# Altium project Laser_driver.PrjPCB (part 1 of 3)
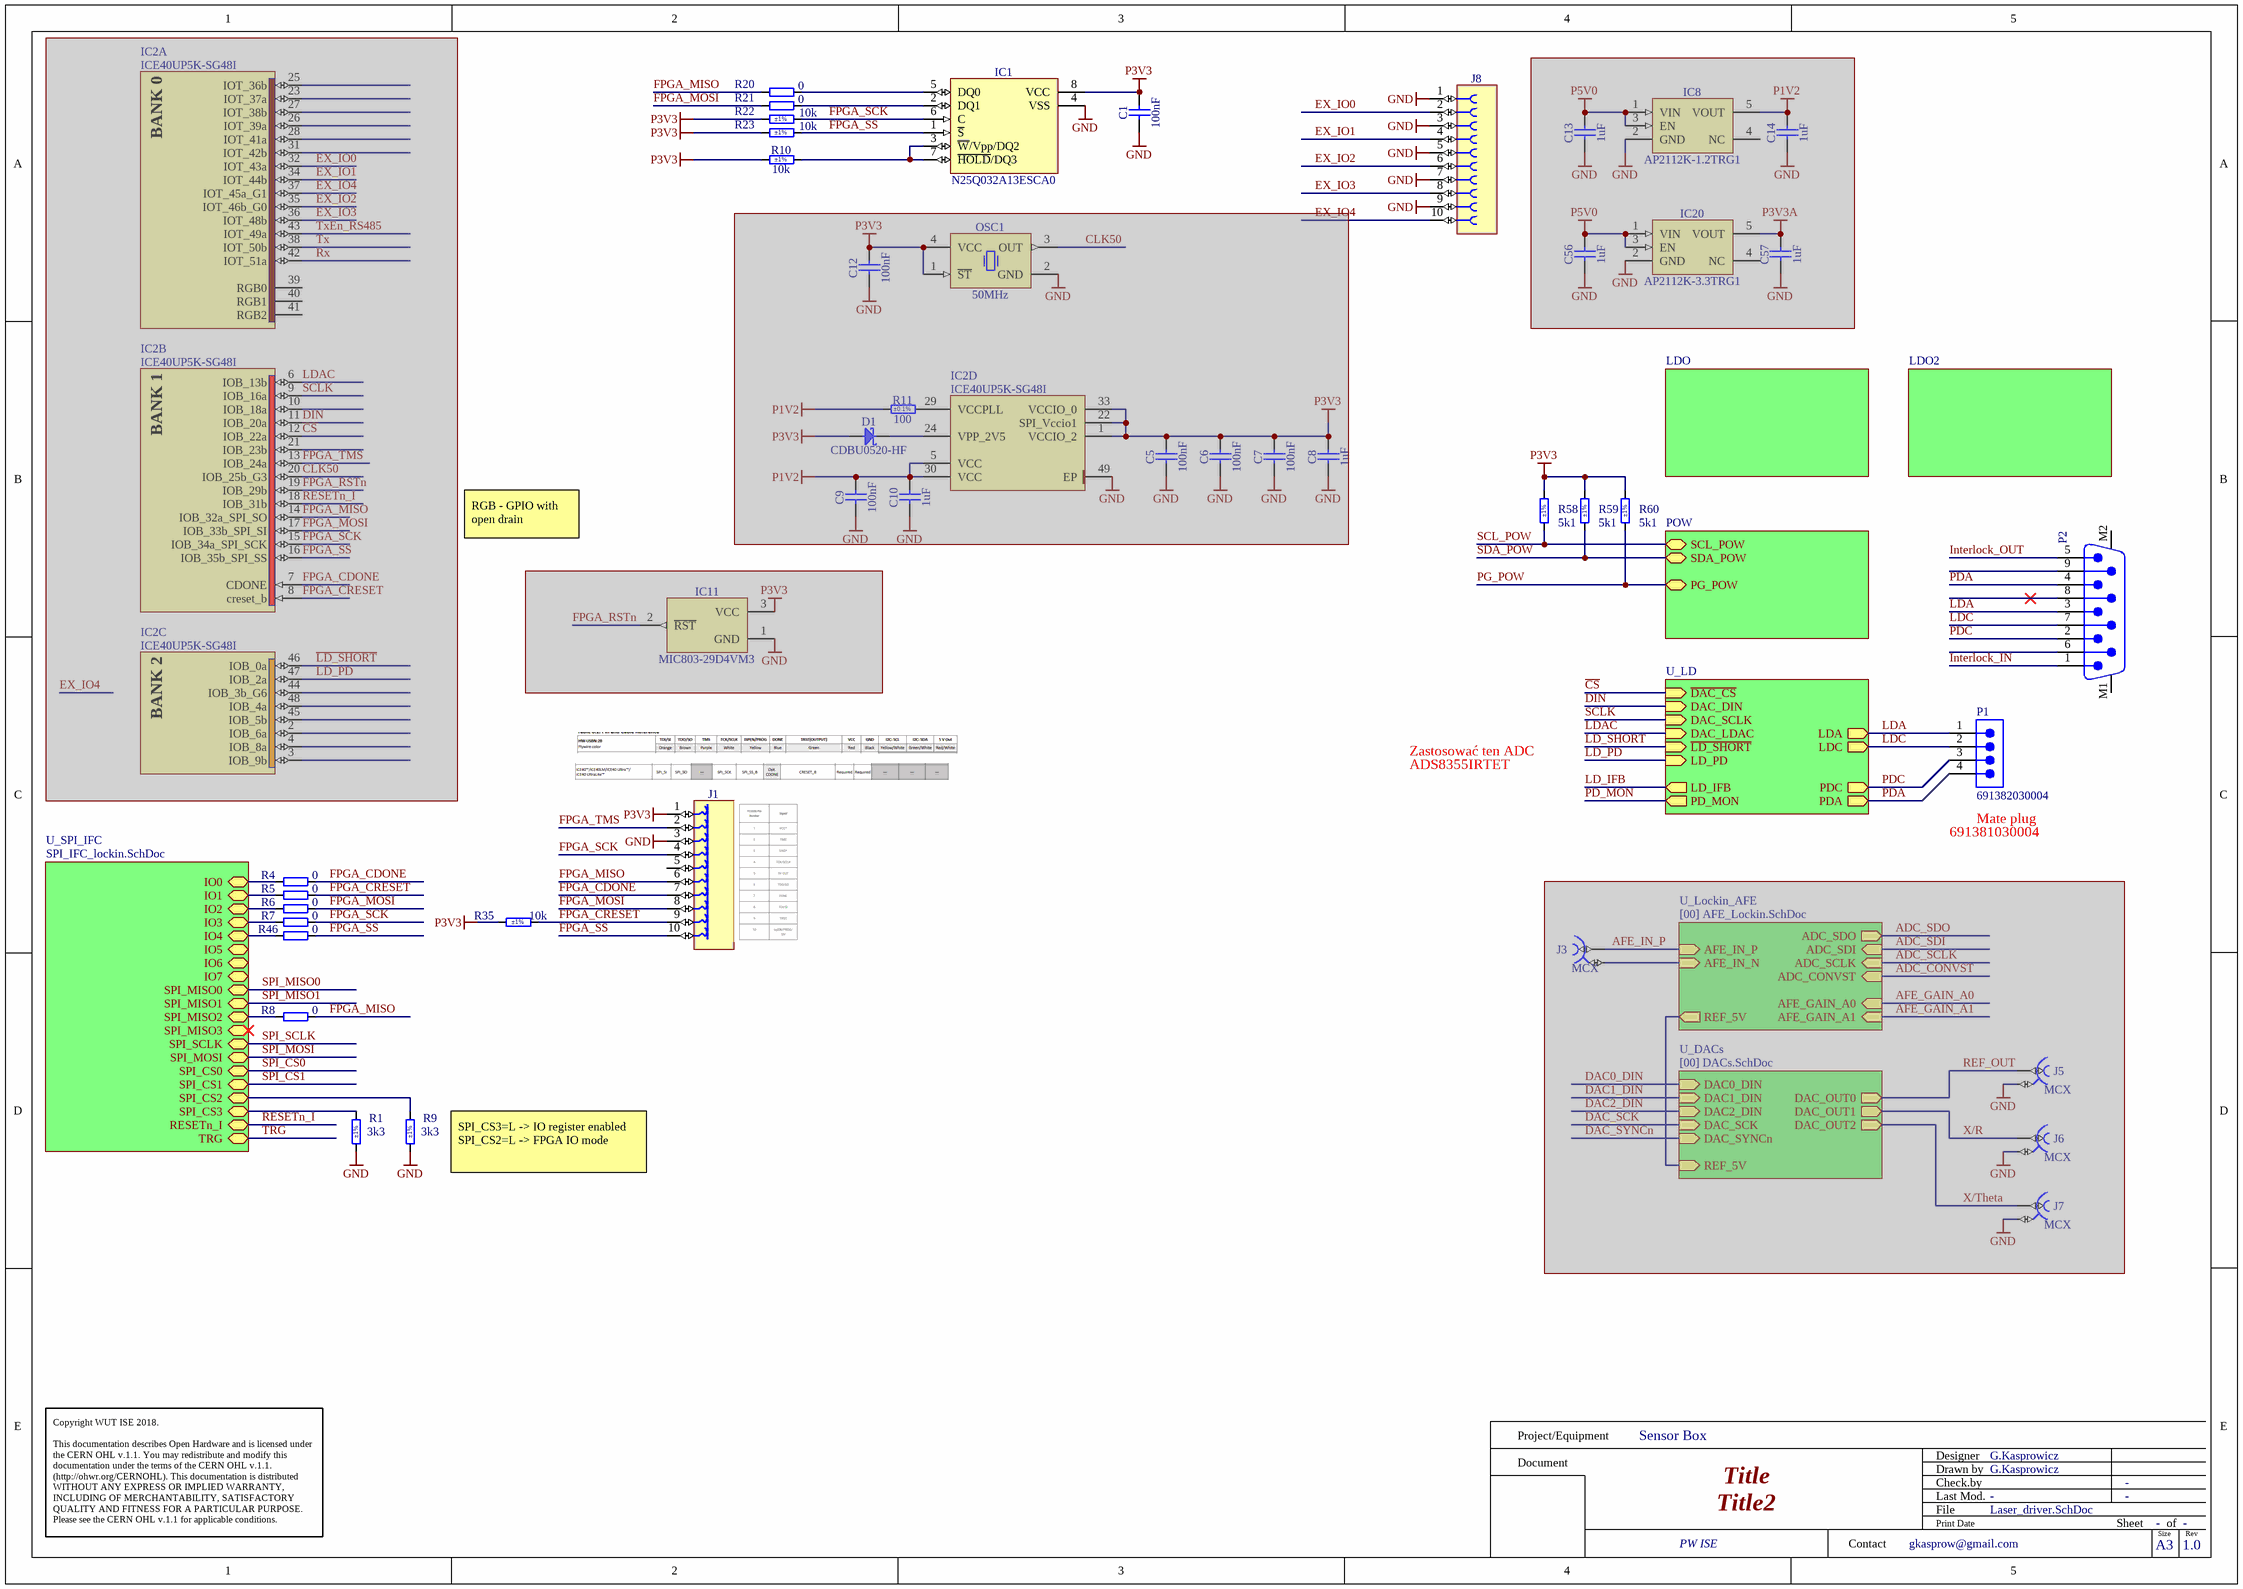
[diagram p0: Laser_driver.SchDoc]
5 sheets, 289 parts. Net scope: hierarchical (ports join the sheet entries above them; power ports are global).
Board file: Laser_driver.PCBDOC
Sheets:
  Laser_driver.SchDoc
    U_SPI_IFC = SPI_IFC_lockin.SchDoc
    U_LD = LD.SchDoc
    LDO = LDO_LD.SchDoc
    LDO2 = OPAmp Supply.SchDoc

## Sheet Laser_driver.SchDoc: Title
size 420 x 297 mm; Author: G.Kasprowicz; CompanyName: WUT ISE; DrawnBy: G.Kasprowicz; Organization: WUT ISE; Address1: PW ISE; Address2: Nowowiejska 15/19 00-665 Warsaw; Address3: gkasprow@gmail.com; Revision: 1.0; SheetNumber: -; SheetTotal: -; ModifiedBy: -; CheckedDate: -; Title2: Title2; DivGrp: WUT ISE; Designer: G.Kasprowicz; SPICEModelCacheRYPVXPCY: <root> / <DocumentId>RYPVXPCY</DocumentId> / </root>; ModifiedDate: -; ProjectName: Sensor Box

### Parts
C1  100nF  [CAPC1005X55N]
C5  100nF  [CAPC1005X55N]  (masked out: inside a compile mask, not in the netlist)
C6  100nF  [CAPC1005X55N]  (masked out: inside a compile mask, not in the netlist)
C7  100nF  [CAPC1005X55N]  (masked out: inside a compile mask, not in the netlist)
C8  1uF  [CAPC1005X55N]  (masked out: inside a compile mask, not in the netlist)
C9  100nF  [CAPC1005X55N]  (masked out: inside a compile mask, not in the netlist)
C10  1uF  [CAPC1005X55N]  (masked out: inside a compile mask, not in the netlist)
C12  100nF  [CAPC1005X55N]  (masked out: inside a compile mask, not in the netlist)
C13  1uF  [CAPC1005X55N]  (masked out: inside a compile mask, not in the netlist)
C14  1uF  [CAPC1005X55N]  (masked out: inside a compile mask, not in the netlist)
C56  1uF  [CAPC1005X55N]  (masked out: inside a compile mask, not in the netlist)
C57  1uF  [CAPC1005X55N]  (masked out: inside a compile mask, not in the netlist)
D1  CDBU0520-HF  [SOD-523F]  (masked out: inside a compile mask, not in the netlist)
IC1  N25Q032A13ESCA0  [SOIC127P600X175-8N]
IC2  ICE40UP5K-SG48I  [QFN50P700X700X100-49N-S550]  (parts A,B,C,D of 4)  (masked out: inside a compile mask, not in the netlist)
IC8  AP2112K-1.2TRG1  [SOT95P285X140-5N]  (masked out: inside a compile mask, not in the netlist)
IC11  MIC803-29D4VM3  [SOT95P237X112-3N]  (masked out: inside a compile mask, not in the netlist)
IC20  AP2112K-3.3TRG1  [SOT95P285X140-5N]  (masked out: inside a compile mask, not in the netlist)
J1  TC2050-IDC  [TC2050-IDC]  (value not drawn)
J3  MCX  [AMPHENOL_919-109J-51PX]  (masked out: inside a compile mask, not in the netlist)
J5  MCX  [AMPHENOL_919-109J-51PX]  (masked out: inside a compile mask, not in the netlist)
J6  MCX  [AMPHENOL_919-109J-51PX]  (masked out: inside a compile mask, not in the netlist)
J7  MCX  [AMPHENOL_919-109J-51PX]  (masked out: inside a compile mask, not in the netlist)
J8  FFC/FPC  [MOLEX_52745-1097]  (value not drawn)
OSC1  50MHz  [OSC_EPSON_SG-310]  (masked out: inside a compile mask, not in the netlist)
P1  691382030004  [691382030004]
P2  61800929221  [61800929221]  (value not drawn)
R1  3k3  Tolerance: ±1%  [RESC1005X40N]
R4  0  [RESC1005X40N]
R5  0  [RESC1005X40N]
R6  0  [RESC1005X40N]
R7  0  [RESC1005X40N]
R8  0  [RESC1005X40N]
R9  3k3  Tolerance: ±1%  [RESC1005X40N]
R10  10k  Tolerance: ±1%  [RESC1005X40N]
R11  100  Tolerance: ±0.1%  [RESC1005X35N]  (masked out: inside a compile mask, not in the netlist)
R20  0  [RESC1005X40N]
R21  0  [RESC1005X40N]
R22  10k  Tolerance: ±1%  [RESC1005X40N]
R23  10k  Tolerance: ±1%  [RESC1005X40N]
R35  10k  Tolerance: ±1%  [RESC1005X40N]
R46  0  [RESC1005X40N]
R58  5k1  Tolerance: ±1%  [RESC1005X40N]
R59  5k1  Tolerance: ±1%  [RESC1005X40N]
R60  5k1  Tolerance: ±1%  [RESC1005X40N]

### Sub-sheets
LDO = LDO_LD.SchDoc: no entries
LDO2 = OPAmp Supply.SchDoc: no entries
POW = [05] POW_LD.SchDoc (file not in this document): SDA_POW (bidir), SCL_POW (bidir), PG_POW (bidir)
U_DACs = [00] DACs.SchDoc (masked out) (file not in this document): DAC0_DIN (in), DAC_SCK (in), DAC_SYNCn (in), DAC1_DIN (in), DAC2_DIN (in), REF_5V (in), DAC_OUT0 (out), DAC_OUT1 (out), DAC_OUT2 (out)
U_LD = LD.SchDoc: LDA (out), LDC (out), PDC (out), PDA (out), ~{LD_SHORT} (in), LD_PD (in), PD_MON (out), ~{DAC_CS} (in), DAC_DIN (in), DAC_SCLK (in), DAC_LDAC (in), LD_IFB (out)
U_Lockin_AFE = [00] AFE_Lockin.SchDoc (masked out) (file not in this document): ADC_SDI (in), ADC_SCLK (in), ADC_SDO (out), ADC_CONVST (in), AFE_GAIN_A0 (in), AFE_GAIN_A1 (in), AFE_IN_N (in), AFE_IN_P (in), REF_5V (out)
U_SPI_IFC = SPI_IFC_lockin.SchDoc: IO0 (bidir), IO1 (bidir), IO2 (bidir), IO3 (bidir), IO4 (bidir), IO5 (bidir), IO6 (bidir), IO7 (bidir), SPI_MISO0 (bidir), SPI_MISO1 (bidir), SPI_MISO2 (bidir), SPI_MISO3 (bidir), SPI_SCLK (bidir), SPI_MOSI (bidir), SPI_CS0 (bidir), SPI_CS1 (bidir), SPI_CS2 (bidir), SPI_CS3 (bidir), RESETn_I (bidir), TRG (bidir)

### Nets
LDC: C1.1 IC1.4(VSS) J1.3 J8.1 J8.3 J8.5 J8.7 J8.9 P1.2 P2.7 R1.2 R9.2 ; sheet U_LD/LDC  [also labelled GND]
P3V3: C1.2 IC1.8(VCC) J1.1 R10.1 R22.1 R23.1 R35.1 R58.1 R59.1 R60.1
~{CS}: sheet U_LD/~{DAC_CS}
DIN: sheet U_LD/DAC_DIN  [project net DAC_DIN]
EX_IO0: J8.2
EX_IO1: J8.4
EX_IO2: J8.6
EX_IO3: J8.8
FPGA_CDONE: J1.7 R4.2
FPGA_CRESET: J1.9 R5.2 R35.2
FPGA_MISO: J1.6 R8.2 R20.1
FPGA_MOSI: J1.8 R6.2 R21.1
FPGA_SCK: IC1.6(C) J1.4 R7.2 R22.2
FPGA_SS: IC1.1(~{S}) J1.10 R23.2 R46.2
FPGA_TMS: J1.2
Interlock_IN: P2.1
Interlock_OUT: P2.5
IO0: R4.1 ; sheet U_SPI_IFC/IO0
IO1: R5.1 ; sheet U_SPI_IFC/IO1
IO2: R6.1 ; sheet U_SPI_IFC/IO2
IO3: R7.1 ; sheet U_SPI_IFC/IO3
IO4: R46.1 ; sheet U_SPI_IFC/IO4
LDA: P1.1 P2.3 ; sheet U_LD/LDA
LDAC: sheet U_LD/DAC_LDAC  [project net DAC_~{LDAC}]
PDA: P1.4 P2.4 ; sheet U_LD/PDA
PDC: P1.3 P2.2 ; sheet U_LD/PDC
PG_POW: R60.2 ; sheet POW/PG_POW
SCL_POW: R58.2 ; sheet POW/SCL_POW
SCLK: sheet U_LD/DAC_SCLK  [project net DAC_SCLK]
SDA_POW: R59.2 ; sheet POW/SDA_POW
SPI_CS2: R9.1 ; sheet U_SPI_IFC/SPI_CS2
SPI_CS3: R1.1 ; sheet U_SPI_IFC/SPI_CS3
SPI_MISO2: R8.1 ; sheet U_SPI_IFC/SPI_MISO2
NetIC1_2: IC1.2(DQ1) R21.2
NetIC1_3: IC1.3(~{W}/Vpp/DQ2) IC1.7(~{HOLD}/DQ3) R10.2
NetIC1_5: IC1.5(DQ0) R20.2

Not connected (* = marked no-connect by the designer): J1 5; J8 10; P2 6 8* 9 M1 M2

### Notes on the sheet
- RGB - GPIO with open drain
- ADS8355IRTET
- Zastosować ten ADC
- (near P1) 691381030004
- (near P1) Mate plug
- (near R9) SPI_CS3=L -> IO register enabled
  SPI_CS2=L -> FPGA IO mode
- Project/Equipment
- Document
- Designer
- Drawn by
- Check.by
- Copyright WUT ISE 2018.
  This documentation describes Open Hardware and is licensed under the CERN OHL v.1.1. You may redistribute and modify this documentation under the terms of the CERN OHL v.1.1. (http://ohwr.org/CERNOHL). This documentation is distributed WITHOUT ANY EXPRESS OR IMPLIED WARRANTY, INCLUDING OF MERCHANTABILITY, SATISFACTORY QUALITY AND FITNESS FOR A PARTICULAR PURPOSE. Please see the CERN OHL v.1.1 for applicable conditions.
- Contact
- File
- Last Mod.
- Print Date
- Sheet
- Size
- A3
- of
- Rev
- (in symbol ICE40UP5K-SG48I, part A) BANK 0
- (in symbol ICE40UP5K-SG48I, part B) BANK 1
- (in symbol ICE40UP5K-SG48I, part C) BANK 2

### Library data of the parts
C1 C5-C7 C9 C12 = CC0402_100NF_16V_10%_X7R: Non-polarised capacitor; Part Description: SMD Multilayer Chip Ceramic Capacitor; Manufacturer: GENERIC; Manufacturer1 Part Number: GRM155R71C104KA88D; Voltage: 16V; TC: X7R; Tolerance: ±10%; Part Number: CC0402_100NF_16V_10%_X7R; Component Kind: Standard; Component Type: Standard; Pin Count: 2; Value: 100nF; Status: Not Recommended; Manufacturer Part Number: CC0402_100NF_16V_10%_X7R; Case: 0402; Mounted: Yes; Socket: No; SMD: Yes; Sense: No; Manufacturer1 Example: MURATA; Manufacturer1 ComponentHeight: 0.55mm; HelpURL: \\cern.ch\dfs\Applications\Altium\Datasheets\CC0402_X7R_MURATA_GRM.pdf; Author: CERN DEM JLC; CreateDate: 05.12.2013; LatestRevisionDate: 03.12.2007
C8 C10 C13 C14 C56 C57 = CC0402_1UF_16V_10%_X5R: Non-polarised capacitor; Part Description: SMD Multilayer Chip Ceramic Capacitor; Manufacturer: GENERIC; Manufacturer1 Part Number: C1005X5R1C105KT; Voltage: 16V; TC: X5R; Tolerance: ±10%; Part Number: CC0402_1UF_16V_10%_X5R; Component Kind: Standard; Component Type: Standard; Pin Count: 2; Value: 1uF; Status: Preferred; Manufacturer Part Number: CC0402_1UF_16V_10%_X5R; Case: 0402; Mounted: Yes; Socket: No; SMD: Yes; Sense: No; Manufacturer1 Example: TDK; Manufacturer1 ComponentHeight: 0.55mm; HelpURL: \\cern.ch\dfs\Applications\Altium\Datasheets\CC0402_X5R_TDK_C.pdf; Author: CERN DEM JLC; CreateDate: 25.10.2012; LatestRevisionDate: 25.10.2012
D1 = CDBU0520-HF: Schottky Diode; Part Description: 20V Surface mount Schottky Barrier Diode; Manufacturer: COMCHIP; Voltage: 20V; Power: 500mA; PressFit: No; Bonding: No; Part Number: CDBU0520-HF; Component Kind: Standard; Component Type: Standard; Device: CDBU0520-HF; PackageDescription: Small Outline Diode Flat Lead (SOD-523F), Body; 1.80mm L X 1mm W X 0.85mm H; Manufacturer Part Number: CDBU0520-HF; Pin Count: 2; Case: SOD-523F; Mounted: Yes; Socket: No; SMD: Yes; Sense: No; ComponentHeight: 1mm; HelpURL: \\cern.ch\dfs\Applications\Altium\Datasheets\CDBU0520-HF.pdf; Author: CERN DEM HF; CreateDate: 13.10.2023; LatestRevisionDate: 13.10.2023
IC1 = N25Q032A13ESCA0: 32Mb, 3V, Multiple I/O Serial Flash Memory; Part Description: 32Mb, 2.7 to 3.6V, Multiple I/O Serial Flash Memory; Manufacturer: MICRON TECHNOLOGY; PressFit: No; Bonding: No; Part Number: N25Q032A13ESCA0; Component Kind: Standard; Component Type: Standard; Device: N25Q032A13ESCA0; PackageDescription: SOIC, 1.27mm Pitch; 8 Pin - Body 4x5mm, IPC Medium Density; Manufacturer Part Number: N25Q032A13ESCA0; Pin Count: 8; Case: SOIC8; Mounted: Yes; Socket: No; SMD: Yes; Sense: No; ComponentHeight: 1.75mm; HelpURL: \\cern.ch\dfs\Applications\Altium\Datasheets\N25Q032A13ESCA0.pdf; Author: CERN DEM HF; CreateDate: 09.12.2024; LatestRevisionDate: 09.12.2024
IC2 = ICE40UP5K-SG48I: ICE40 Ultra FPGA, 3520 Logic Cells, 400 kHz Data Transfer Speed, 48 pin QFN; Part Description: ICE40 Ultra FPGA, 5280 Logic Cells, 400 kHz Data Transfer Speed, 48 pin QFN; Manufacturer: LATTICE SEMICONDUCTOR; PressFit: No; Bonding: No; Part Number: ICE40UP5K-SG48I; Component Kind: Standard; Component Type: Standard; Device: ICE40UP5K-SG48I; PackageDescription: QFN, 0.50mm Pitch, Square; 48 Pin, 7.00mm L X 7.00mm W X 1.00mm H body (w/Thermal Tab 5.50mm X 5.40mm), IPC Medium Density; Manufacturer Part Number: ICE40UP5K-SG48I; Pin Count: 49; Case: QFN48; Mounted: Yes; Socket: No; SMD: Yes; Sense: No; ComponentHeight: 1.00mm; HelpURL: \\cern.ch\dfs\Applications\Altium\Datasheets\ICE40UP5K.pdf; ComponentLink1URL: \\cern.ch\dfs\Applications\Altium\Datasheets\LATTICE_Packege.pdf; ComponentLink1Description: Package; ComponentLink2URL: \\cern.ch\dfs\Applications\Altium\Datasheets\ICE40UP5K_Pinout.xlsx; ComponentLink2Description: Pinout; Author: CERN DEM HF; CreateDate: 16.12.2024; LatestRevisionDate: 16.12.2024
IC8 = REG_AP2112K-1.2: 600mA CMOS Low Dropout Linear Regulator with Enable; Part Description: 1.2V 600mA CMOS Low Dropout Linear Regulator with Enable; Manufacturer: DIODES INCORPORATED; PressFit: No; Bonding: No; Part Number: AP2112K-1.2TRG1; Component Kind: Standard; Component Type: Standard; Device: AP2112K-1.2TRG1; PackageDescription: SOT23, 0.95mm Pitch; 5 Pin, 1.6mm W X 3.0mm L X 1.40mm H body, IPC Medium Density; Manufacturer Part Number: AP2112K-1.2TRG1; Pin Count: 5; Case: SOT25; Mounted: Yes; Socket: No; SMD: Yes; Sense: No; ComponentHeight: 1.4mm; HelpURL: \\cern.ch\dfs\Applications\Altium\Datasheets\AP2112K-3.3TRG1.pdf; Author: GK; CreateDate: 13.12.2017; LatestRevisionDate: 27.06.2022
IC11 = MIC803-29D4VM3: 3.075V Microprocessor Supervisor Circuit With Open-Drain Reset Output; Part Description: 2.93V Microprocessor Supervisor Circuit with Open-Drain Reset Output; Manufacturer: MICROCHIP TECHNOLOGY; PressFit: No; Bonding: No; Part Number: MIC803-29D4VM3; Component Kind: Standard; Component Type: Standard; Device: MIC803-29D4VM3; PackageDescription: SOT, 0.95mm Pitch; 3 Pin, 1.30mm W X 2.92mm L X 1.12mm H body, IPC Medium Density; Manufacturer Part Number: MIC803-29D4VM3; Pin Count: 3; Case: SOT23-3; Mounted: Yes; Socket: No; SMD: Yes; Sense: No; ComponentHeight: 1.12mm; Author: CERN DEM BC; HelpURL: \\cern.ch\dfs\Applications\Altium\Datasheets\MIC803.pdf; CreateDate: 29.04.2020; LatestRevisionDate: 29.04.2020
IC20 = AP2112K-3.3TRG1: 600mA CMOS Low Dropout Linear Regulator with Enable; Part Description: 3.3V 600mA CMOS Low Dropout Linear Regulator with Enable; Manufacturer: DIODES INCORPORATED; PressFit: No; Bonding: No; Part Number: AP2112K-3.3TRG1; Component Kind: Standard; Component Type: Standard; Device: AP2112K-3.3TRG1; PackageDescription: SOT23, 0.95mm Pitch; 5 Pin, 1.6mm W X 3.0mm L X 1.40mm H body, IPC Medium Density; Manufacturer Part Number: AP2112K-3.3; Pin Count: 5; Case: SOT25; Mounted: Yes; Socket: No; SMD: Yes; Sense: No; ComponentHeight: 1.4mm; HelpURL: \\cern.ch\dfs\Applications\Altium\Datasheets\AP2112K-3.3TRG1.pdf; Author: CERN DEM MR; CreateDate: 13.12.2017; LatestRevisionDate: 27.06.2022
J1 = TC2050-IDC: TC2030-MCP and TC2050-IDC Pad Contact; Part Description: 10 X 31mil Diameter SMD Pad For TC2050-IDC Legged Connector; Mounted: No; Part Number: TC2050-IDC; Component Kind: Standard (No BOM); Component Type: Standard (No BOM); Pin Count: 10; Family: TC2050-IDC; Socket: No; SMD: Yes; Sense: No; Status: None; ComponentHeight: 0mm; HelpURL: \\cern.ch\dfs\Applications\Altium\Datasheets\TC2050-IDC.pdf; Author: CERN DEM HF; CreateDate: 02.05.2024; LatestRevisionDate: 02.05.2024; PackageDescription: 10 X 31mil Diameter SMD Pad For TC2030-MCP Legged Connector
J3 J5-J7 = AMPHENOL_919-109J-51PX: Part Description: 50 Ohms, RF Connector, MCX Straight PCB Receptacle Jack; Manufacturer Part Number: 919-109J-51PX (MCX6251B1-3GT30G-50); PressFit: No; Part Number: AMPHENOL_919-109J-51PX; Component Kind: Standard; Component Type: Standard; Pin Count: 5; Family: MCX; Mounted: Yes; Socket: No; SMD: No; Sense: No; Status: None; Manufacturer: AMPHENOL; ComponentHeight: 6.06mm; HelpURL: \\cern.ch\dfs\Applications\Altium\Datasheets\AMPHENOL_919-109J-51PX.pdf; Author: CERN DEM BC; CreateDate: 31.01.2019; LatestRevisionDate: 31.01.2019
J8 = MOLEX_52745-1097: Connector 10 Female; Part Description: 10 Contacts, 0.5mm Pitch, Right Angled Surface Mount FFC/FPC Connector, ZIF, Top Contact Style; Manufacturer: MOLEX; PressFit: No; Part Number: MOLEX_52745-1097; Component Kind: Standard; Component Type: Standard; Pin Count: 10; Family: FFC/FPC; Mounted: Yes; Socket: No; SMD: Yes; Sense: No; Status: None; Manufacturer Part Number: 52745-1097; ComponentHeight: 2mm; HelpURL: \\cern.ch\dfs\Applications\Altium\Datasheets\MOLEX_52745-1097.pdf; Author: CERN DEM JLC; CreateDate: 04.11.2014; LatestRevisionDate: 05.12.2014
OSC1 = OSC_50MHZ_EPSON_SG-310SCN: Oscillator 4 pins 1=\ST 2=GND 3=OUT 4=VCC; Part Description: 3.3V, ±100ppm, 15pF -40..85°C, Stanby Function , Surface Mount Crystal Oscillator (SG-310 Series); Manufacturer: EPSON TOYOCOM; Manufacturer Part Number: SG-310 SCN 50.0000MJ; PressFit: No; Bonding: No; Part Number: OSC_50MHZ_EPSON_SG-310SCN; Component Kind: Standard; Component Type: Standard; PackageDescription: Oscillator, Corner Concave; 4 Pin, 2.5mm L X 3.2mm W X 1.2mm H; Value: 50MHz; Pin Count: 4; Mounted: Yes; Socket: No; SMD: Yes; Sense: No; ComponentHeight: 1.2mm; HelpURL: \\cern.ch\dfs\Applications\Altium\Datasheets\OSC_EPSON_SG-310.pdf; ComponentLink1URL: \\cern.ch\dfs\Applications\Altium\Datasheets\OSC_EPSON_SG-310_Ordering-Informations.pdf; ComponentLink1Description: Ordering Informations; Author: CERN DEM JLC; CreateDate: 31.03.2010; LatestRevisionDate: 31.03.2010
P1 = 691382030004: WR-TBL Series 382 Vertical PCB Header with Flanges, THT, pitch 2.5mm, 04p; Manufacturer: Wurth Elektronik; Modularity: No; Rated Current: 12A; System: Pluggable Connector; Working Voltage: 300V; Manufacturer Part Number: 691382030004; Category: Terminal Block; Match Code: WR-TBL; ComponentLink1Description: Website Link; ComponentLink1URL: https://www.we-online.com/redexpert/article/691382030004?ad; ComponentLink2Description: Datasheet Link; ComponentLink2URL: https://www.we-online.com/redexpert/spec/691382030004?ad; Mount: Through Hole; Min Operating Temperature: -40°C; Max Operating Temperature: 105°C; Packaging: Box; Application: Pluggable; Number of Pins: 4; Number of Rows: 1; Orientation: Vertical; Pitch: 2.5mm
P2 = 61800929221: WR-DSUB Male PCB Connector with Hex Screw, THT, Straight, 9p; Manufacturer: Wurth Elektronik; Contact Resistance: 30mΩ; Rated Current: 3A; Working Voltage: 250VAC; Withstanding Voltage: 1000VAC; Manufacturer Part Number: 61800929221; Category: Input/Output Connector; Match Code: WR-DSUB; ComponentLink1Description: Website Link; ComponentLink1URL: https://www.we-online.com/redexpert/article/61800929221?ad; ComponentLink2Description: Datasheet Link; ComponentLink2URL: https://www.we-online.com/redexpert/spec/61800929221?ad; Mount: Through Hole; Min Operating Temperature: -55°C; Max Operating Temperature: 105°C; Packaging: Tray; Gender: Male; Number of Pins: 9; Orientation: Straight
R1 R9 = R0402_3K3_1%_0.0625W_100PPM: Resistor - 1%; Part Description: General Purpose Thick Film Chip Resistor; Manufacturer: GENERIC; Manufacturer1 Part Number: 232270673302L; TC: ±100ppm/°C; PressFit: No; Part Number: R0402_3K3_1%_0.0625W_100PPM; Component Kind: Standard; Component Type: Standard; Pin Count: 2; Value: 3k3; Status: Not Recommended; Power: 0.0625W; Manufacturer Part Number: R0402_3K3_1%_0.0625W_100PPM; Case: 0402; Mounted: Yes; Sense: No; Socket: No; SMD: Yes; Manufacturer1 Example: YAGEO PHYCOMP; Manufacturer1 ComponentHeight: 0.4mm; HelpURL: \\cern.ch\dfs\Applications\Altium\Datasheets\R0402_Phycomp_RC0402.pdf; Author: CERN DEM JLC; CreateDate: 03.12.2007; LatestRevisionDate: 17.10.2012
R4-R8 R20 R21 R46 = R0402_0R_JUMPER: Resistor; Part Description: 1A (0.05R Max DC Resistance) Zero Ohm Jumper; Manufacturer: GENERIC; Manufacturer1 Part Number: 232270591001L; PressFit: No; Part Number: R0402_0R_JUMPER; Component Kind: Standard; Component Type: Standard; Pin Count: 2; Value: 0; Status: Not Recommended; Manufacturer Part Number: R0402_0R_JUMPER; Case: 0402; Mounted: Yes; Sense: No; Socket: No; SMD: Yes; Manufacturer1 Example: YAGEO PHYCOMP; Manufacturer1 ComponentHeight: 0.4mm; HelpURL: \\cern.ch\dfs\Applications\Altium\Datasheets\R0402_Phycomp_RC0402.pdf; Author: CERN DEM JLC; CreateDate: 03.12.2007; LatestRevisionDate: 17.10.2012
R10 R22 R23 R35 = R0402_10K_1%_0.0625W_100PPM: Resistor - 1%; Part Description: General Purpose Thick Film Chip Resistor; Manufacturer: GENERIC; Manufacturer1 Part Number: 232270671003L; TC: ±100ppm/°C; PressFit: No; Part Number: R0402_10K_1%_0.0625W_100PPM; Component Kind: Standard; Component Type: Standard; Pin Count: 2; Value: 10k; Status: Not Recommended; Power: 0.0625W; Manufacturer Part Number: R0402_10K_1%_0.0625W_100PPM; Case: 0402; Mounted: Yes; Sense: No; Socket: No; SMD: Yes; Manufacturer1 Example: YAGEO PHYCOMP; Manufacturer1 ComponentHeight: 0.4mm; HelpURL: \\cern.ch\dfs\Applications\Altium\Datasheets\R0402_Phycomp_RC0402.pdf; Author: CERN DEM JLC; CreateDate: 03.12.2007; LatestRevisionDate: 17.10.2012
R11 = R0402_100R_0.1%_0.063W_25PPM: Resistor - 0.1%; Part Description: Thin Film Precision Resistor; Manufacturer: GENERIC; Manufacturer1 Part Number: CPF0402B100RE1; Power: 0.063W; TC: ±25ppm/°C; PressFit: No; Part Number: R0402_100R_0.1%_0.063W_25PPM; Component Kind: Standard; Component Type: Standard; Pin Count: 2; Value: 100; Status: Not Recommended; Manufacturer Part Number: R0402_100R_0.1%_0.063W_25PPM; Case: 0402; Mounted: Yes; Sense: No; Socket: No; SMD: Yes; Manufacturer1 Example: TE CONNECTIVITY; Manufacturer1 ComponentHeight: 0.35mm; HelpURL: \\cern.ch\dfs\Applications\Altium\Datasheets\R0402_TYCO_CPF.pdf; Author: CERN DEM JMW; CreateDate: 22.09.2015; LatestRevisionDate: 22.09.2015
R58-R60 = R0402_5K1_1%_0.0625W_100PPM: Resistor - 1%; Part Description: General Purpose Thick Film Chip Resistor; Manufacturer: GENERIC; Manufacturer1 Part Number: 232270675102L; TC: ±100ppm/°C; PressFit: No; Part Number: R0402_5K1_1%_0.0625W_100PPM; Component Kind: Standard; Component Type: Standard; Pin Count: 2; Value: 5k1; Status: Not Recommended; Power: 0.0625W; Manufacturer Part Number: R0402_5K1_1%_0.0625W_100PPM; Case: 0402; Mounted: Yes; Sense: No; Socket: No; SMD: Yes; Manufacturer1 Example: YAGEO PHYCOMP; Manufacturer1 ComponentHeight: 0.4mm; HelpURL: \\cern.ch\dfs\Applications\Altium\Datasheets\R0402_Phycomp_RC0402.pdf; Author: CERN DEM JLC; CreateDate: 03.12.2007; LatestRevisionDate: 17.10.2012

## Sheet SPI_IFC_lockin.SchDoc: Title
size 420 x 297 mm; Author: G.Kasprowicz; CompanyName: WUT ISE; DrawnBy: G.Kasprowicz; Organization: WUT ISE; Address1: PW ISE; Address2: Nowowiejska 15/19 00-665 Warsaw; Address3: gkasprow@gmail.com; Revision: 1.0; SheetNumber: -; SheetTotal: -; ModifiedBy: -; CheckedDate: -; Title2: Title2; DivGrp: WUT ISE; Designer: G.Kasprowicz; SPICEModelCacheRYPVXPCY: <root> / <DocumentId>RYPVXPCY</DocumentId> / </root>; ModifiedDate: -; ProjectName: Sensor Box
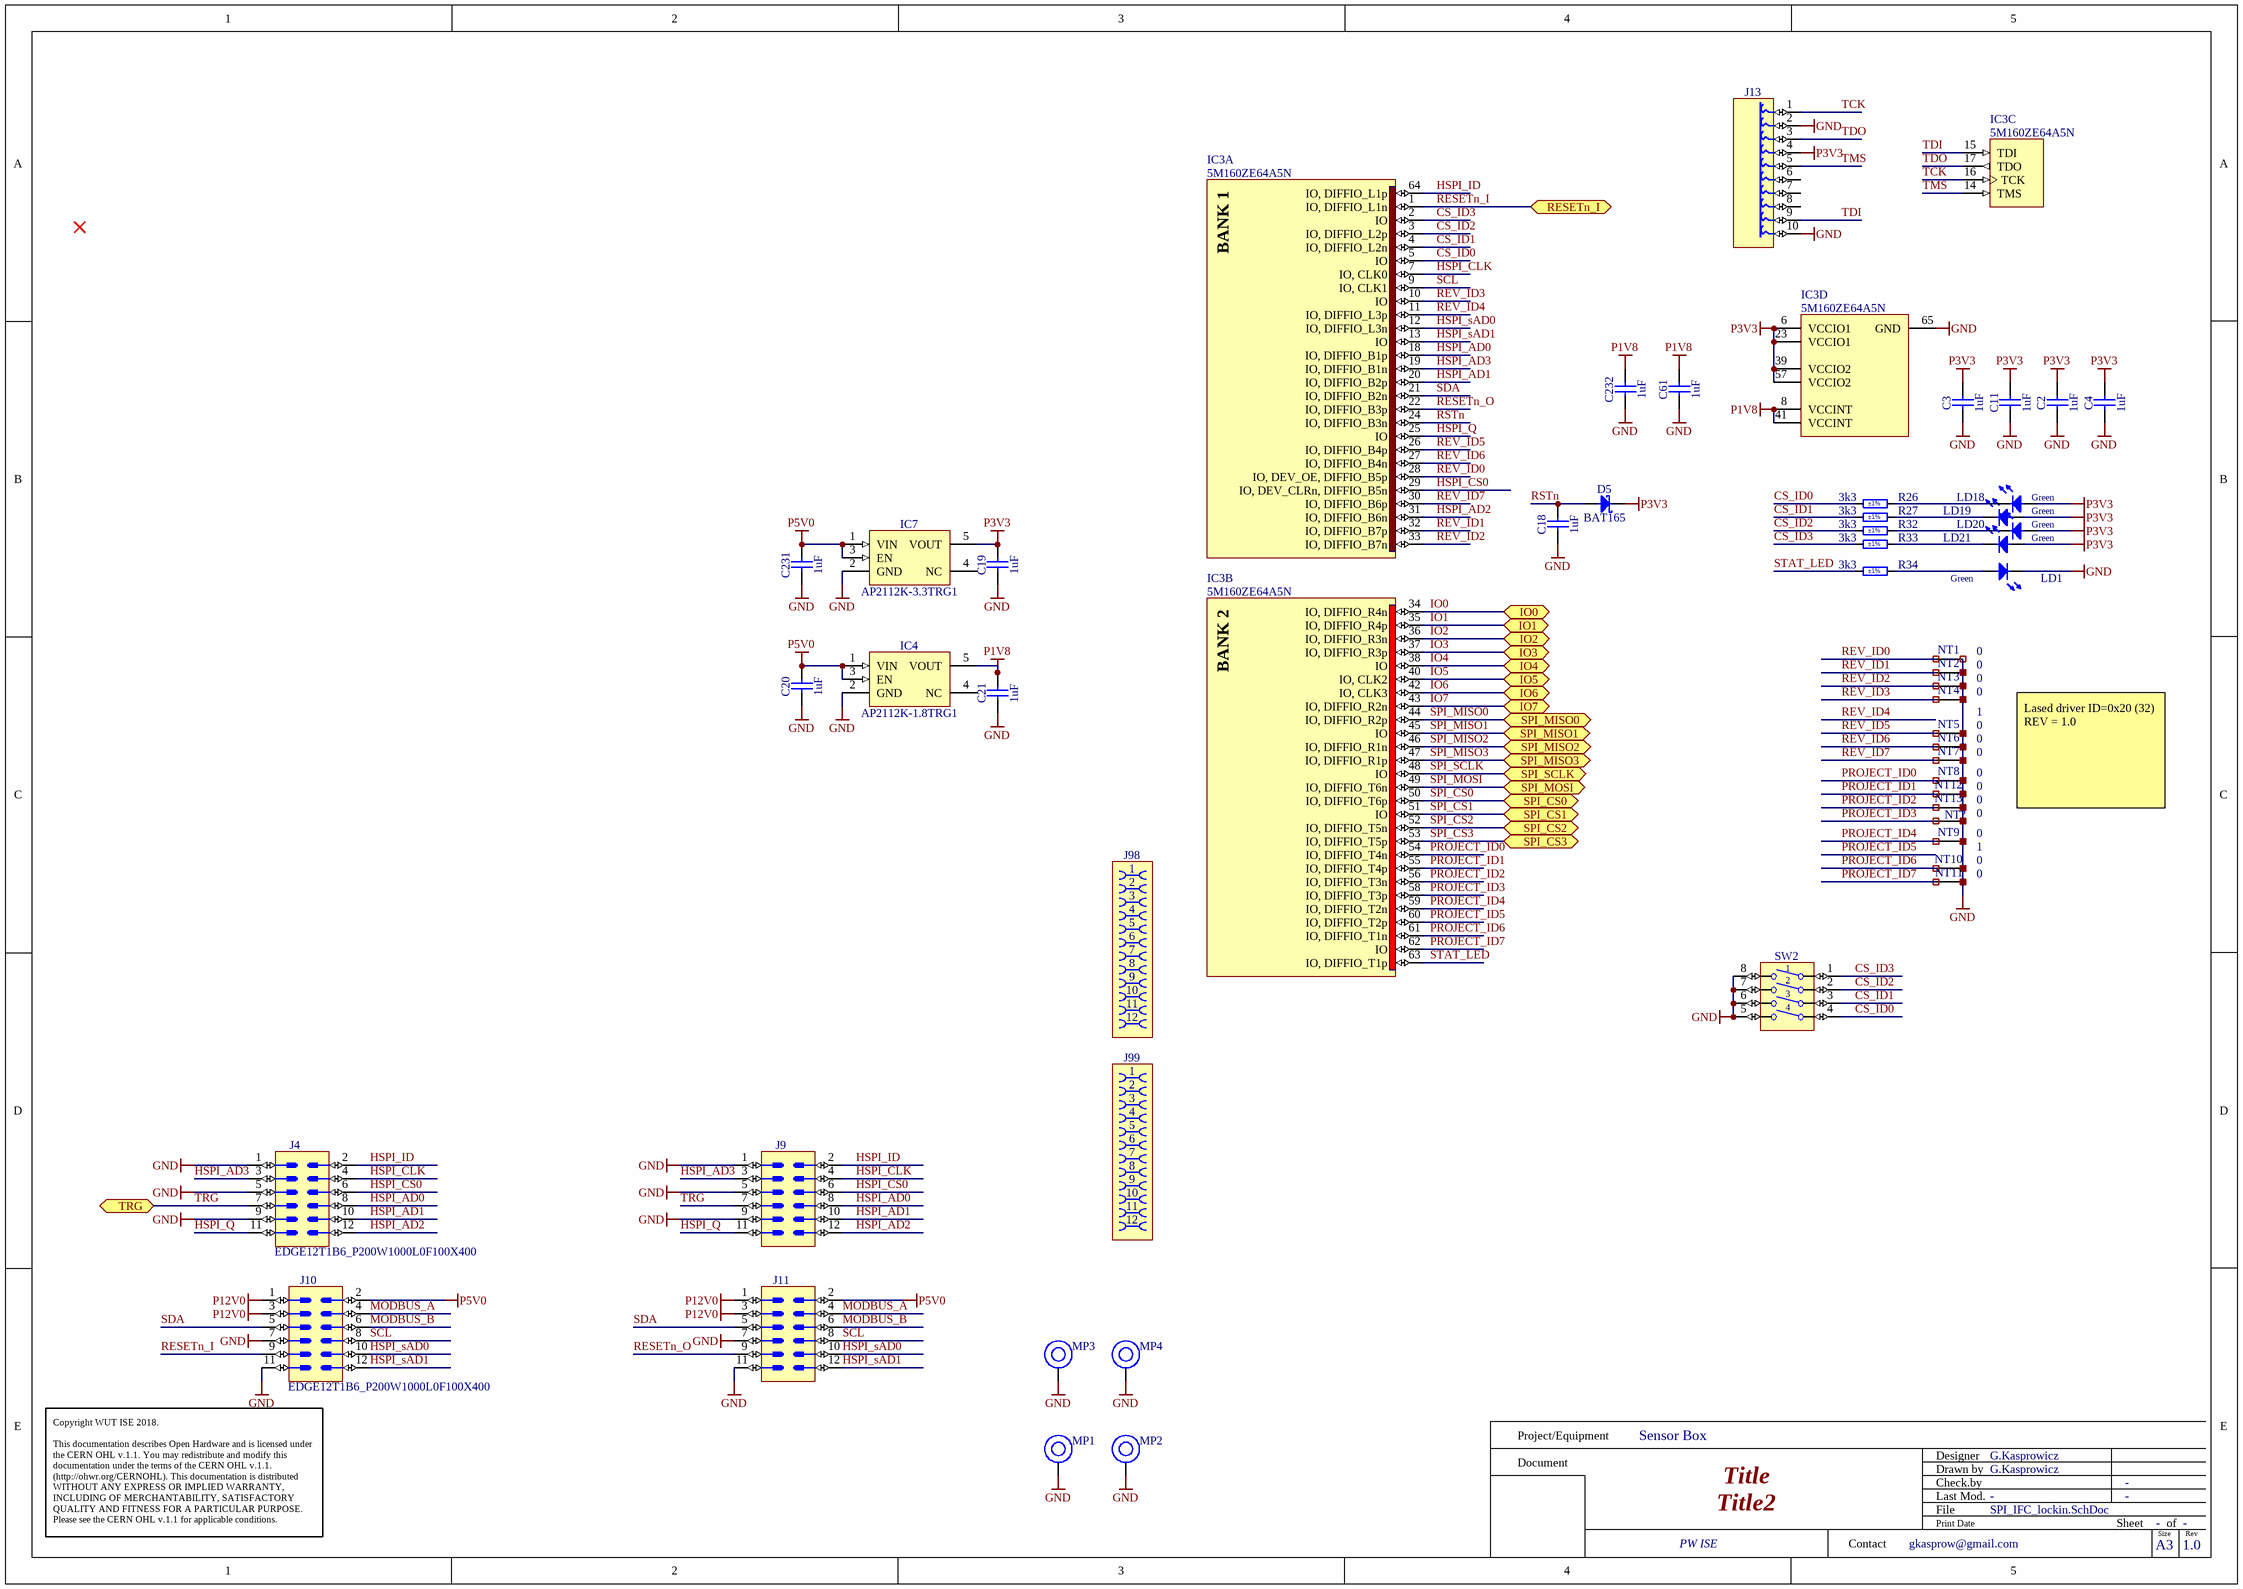
[diagram p1: SPI_IFC_lockin.SchDoc]

### Parts
C2  1uF  [CAPC1005X55N]
C3  1uF  [CAPC1005X55N]
C4  1uF  [CAPC1005X55N]
C11  1uF  [CAPC1005X55N]
C18  1uF  [CAPC1005X55N]
C19  1uF  [CAPC1005X55N]
C20  1uF  [CAPC1005X55N]
C21  1uF  [CAPC1005X55N]
C61  1uF  [CAPC1005X55N]
C231  1uF  [CAPC1005X55N]
C232  1uF  [CAPC1005X55N]
D5  BAT165  [SOD2512X110N]
IC3  5M160ZE64A5N  [QFP40P900X900X120-65N-S550]  (parts A,B,C,D of 4)
IC4  AP2112K-1.8TRG1  [SOT95P285X140-5N]
IC7  AP2112K-3.3TRG1  [SOT95P285X140-5N]
J4  (no value)  [EDGE12T1B6_P200W1000L0F100X400]
J9  (no value)  [EDGE12T5B10_P200W1000L0F100X400]
J10  (no value)  [EDGE12T1B6_P200W1000L0F100X400]
J11  (no value)  [EDGE12T5B10_P200W1000L0F100X400]
J13  TC2050-IDC  [TC2050-IDC]  (value not drawn)
J98  (no value)  [AVX_009159012761916]
J99  (no value)  [AVX_009159012761916]
LD1  Green  [LED_KINGBRIGHT_KP-1608CGCK]
LD18  Green  [LED_KINGBRIGHT_KP-1608CGCK]
LD19  Green  [LED_KINGBRIGHT_KP-1608CGCK]
LD20  Green  [LED_KINGBRIGHT_KP-1608CGCK]
LD21  Green  [LED_KINGBRIGHT_KP-1608CGCK]
MP1  M1.6 x 3mm  [97730306330]  (value not drawn)
MP2  M1.6 x 3mm  [97730306330]  (value not drawn)
MP3  M1.6 x 3mm  [97730306330]  (value not drawn)
MP4  M1.6 x 3mm  [97730306330]  (value not drawn)
NT1  Net Tie  [Net Tie 3]  (value not drawn)  (net tie, no BOM)
NT2  Net Tie  [Net Tie 3]  (value not drawn)  (net tie, no BOM)
NT3  Net Tie  [Net Tie 3]  (value not drawn)  (net tie, no BOM)
NT4  Net Tie  [Net Tie 3]  (value not drawn)  (net tie, no BOM)
NT5  Net Tie  [Net Tie 3]  (value not drawn)  (net tie, no BOM)
NT6  Net Tie  [Net Tie 3]  (value not drawn)  (net tie, no BOM)
NT7  Net Tie  [Net Tie 3]  (value not drawn)  (net tie, no BOM)
NT8  Net Tie  [Net Tie 3]  (value not drawn)  (net tie, no BOM)
NT9  Net Tie  [Net Tie 3]  (value not drawn)  (net tie, no BOM)
NT10  Net Tie  [Net Tie 3]  (value not drawn)  (net tie, no BOM)
NT11  Net Tie  [Net Tie 3]  (value not drawn)  (net tie, no BOM)
NT12  Net Tie  [Net Tie 3]  (value not drawn)  (net tie, no BOM)
NT13  Net Tie  [Net Tie 3]  (value not drawn)  (net tie, no BOM)
NT?  Net Tie  [Net Tie 3]  (value not drawn)  (net tie, no BOM)
R26  3k3  Tolerance: ±1%  [RESC1005X40N]
R27  3k3  Tolerance: ±1%  [RESC1005X40N]
R32  3k3  Tolerance: ±1%  [RESC1005X40N]
R33  3k3  Tolerance: ±1%  [RESC1005X40N]
R34  3k3  Tolerance: ±1%  [RESC1005X40N]
SW2  Switch  [SW_OMRON_A6H-4102]  (value not drawn)

### Ports
IO0 (bidir), IO1 (bidir), IO2 (bidir), IO3 (bidir), IO4 (bidir), IO5 (bidir), IO6 (bidir), IO7 (bidir), RESETn_I (bidir), SPI_CS0 (bidir), SPI_CS1 (bidir), SPI_CS2 (bidir), SPI_CS3 (bidir), SPI_MISO0 (bidir), SPI_MISO1 (bidir), SPI_MISO2 (bidir), SPI_MISO3 (bidir), SPI_MOSI (bidir), SPI_SCLK (bidir), TRG (bidir)

### Nets
GND: C2.1 C3.1 C4.1 C11.1 C18.1 C19.1 C20.1 C21.1 C61.1 C231.1 C232.1 IC3.65(GND) IC4.2(GND) IC7.2(GND) J4.1 J4.5 J4.9 J9.1 J9.5 J9.9 J10.7 J10.11 J11.7 J11.11 J13.2 J13.10 LD1.1(C) MP1.1 MP2.1 MP3.1 MP4.1 NT1.2 NT2.2 NT3.2 NT4.2 NT5.2 NT6.2 NT7.2 NT8.2 NT9.2 NT10.2 NT11.2 NT12.2 NT13.2 NT?.2 SW2.5 SW2.6 SW2.7 SW2.8  [project net LDC]
P1V8: C21.2 C61.2 C232.2 IC3.8(VCCINT) IC3.41(VCCINT) IC4.5(VOUT)
P3V3: C2.2 C3.2 C4.2 C11.2 C19.2 D5.1(C) IC3.6(VCCIO1) IC3.23(VCCIO1) IC3.39(VCCIO2) IC3.57(VCCIO2) IC7.5(VOUT) J13.4 LD18.2(A) LD19.2(A) LD20.2(A) LD21.2(A)
P5V0: C20.2 C231.2 IC4.1(VIN) IC4.3(EN) IC7.1(VIN) IC7.3(EN) J10.2 J11.2
P12V0: J10.1 J10.3 J11.1 J11.3
CS_ID0: IC3.5(IO) R26.2 SW2.4
CS_ID1: IC3.4(IO,_DIFFIO_L2n) R27.2 SW2.3
CS_ID2: IC3.3(IO,_DIFFIO_L2p) R32.2 SW2.2
CS_ID3: IC3.2(IO) R33.2 SW2.1
HSPI_AD0: IC3.18(IO,_DIFFIO_B1p) J4.8 J9.8
HSPI_AD1: IC3.20(IO,_DIFFIO_B2p) J4.10 J9.10
HSPI_AD2: IC3.31(IO,_DIFFIO_B6n) J4.12 J9.12
HSPI_AD3: IC3.19(IO,_DIFFIO_B1n) J4.3 J9.3
HSPI_CLK: IC3.7(IO,_CLK0) J4.4 J9.4
HSPI_CS0: IC3.29(IO,_DEV_CLRn,_DIFFIO_B5n) J4.6 J9.6
HSPI_ID: IC3.64(IO,_DIFFIO_L1p) J4.2 J9.2
HSPI_Q: IC3.25(IO) J4.11 J9.11
HSPI_sAD0: IC3.12(IO,_DIFFIO_L3n) J10.10 J11.10
HSPI_sAD1: IC3.13(IO) J10.12 J11.12
IO0: IC3.34(IO,_DIFFIO_R4n) ; port IO0
IO1: IC3.35(IO,_DIFFIO_R4p) ; port IO1
IO2: IC3.36(IO,_DIFFIO_R3n) ; port IO2
IO3: IC3.37(IO,_DIFFIO_R3p) ; port IO3
IO4: IC3.38(IO) ; port IO4
IO5: IC3.40(IO,_CLK2) ; port IO5
IO6: IC3.42(IO,_CLK3) ; port IO6
IO7: IC3.43(IO,_DIFFIO_R2n) ; port IO7
MODBUS_A: J10.4 J11.4
MODBUS_B: J10.6 J11.6
PROJECT_ID0: IC3.54(IO,_DIFFIO_T4n) NT8.1
PROJECT_ID1: IC3.55(IO,_DIFFIO_T4p) NT12.1
PROJECT_ID2: IC3.56(IO,_DIFFIO_T3n) NT13.1
PROJECT_ID3: IC3.58(IO,_DIFFIO_T3p) NT?.1
PROJECT_ID4: IC3.59(IO,_DIFFIO_T2n) NT9.1
PROJECT_ID5: IC3.60(IO,_DIFFIO_T2p)
PROJECT_ID6: IC3.61(IO,_DIFFIO_T1n) NT10.1
PROJECT_ID7: IC3.62(IO) NT11.1
RESETn_I: IC3.1(IO,_DIFFIO_L1n) J10.9 ; port RESETn_I
RESETn_O: IC3.22(IO,_DIFFIO_B3p) J11.9
REV_ID0: IC3.28(IO,_DEV_OE,_DIFFIO_B5p) NT1.1
REV_ID1: IC3.32(IO,_DIFFIO_B7p) NT2.1
REV_ID2: IC3.33(IO,_DIFFIO_B7n) NT3.1
REV_ID3: IC3.10(IO) NT4.1
REV_ID4: IC3.11(IO,_DIFFIO_L3p)
REV_ID5: IC3.26(IO,_DIFFIO_B4p) NT5.1
REV_ID6: IC3.27(IO,_DIFFIO_B4n) NT6.1
REV_ID7: IC3.30(IO,_DIFFIO_B6p) NT7.1
RSTn: C18.2 D5.2(A) IC3.24(IO,_DIFFIO_B3n)
SCL: IC3.9(IO,_CLK1) J10.8 J11.8
SDA: IC3.21(IO,_DIFFIO_B2n) J10.5 J11.5
SPI_CS0: IC3.50(IO,_DIFFIO_T6p) ; port SPI_CS0
SPI_CS1: IC3.51(IO) ; port SPI_CS1
SPI_CS2: IC3.52(IO,_DIFFIO_T5n) ; port SPI_CS2
SPI_CS3: IC3.53(IO,_DIFFIO_T5p) ; port SPI_CS3
SPI_MISO0: IC3.44(IO,_DIFFIO_R2p) ; port SPI_MISO0
SPI_MISO1: IC3.45(IO) ; port SPI_MISO1
SPI_MISO2: IC3.46(IO,_DIFFIO_R1n) ; port SPI_MISO2
SPI_MISO3: IC3.47(IO,_DIFFIO_R1p) ; port SPI_MISO3
SPI_MOSI: IC3.49(IO,_DIFFIO_T6n) ; port SPI_MOSI
SPI_SCLK: IC3.48(IO) ; port SPI_SCLK
STAT_LED: IC3.63(IO,_DIFFIO_T1p) R34.2
TCK: IC3.16(TCK) J13.1
TDI: IC3.15(TDI) J13.9
TDO: IC3.17(TDO) J13.3
TMS: IC3.14(TMS) J13.5
TRG: J4.7 J9.7 ; port TRG
NetLD1_2: LD1.2(A) R34.1
NetLD18_1: LD18.1(C) R26.1
NetLD19_1: LD19.1(C) R27.1
NetLD20_1: LD20.1(C) R32.1
NetLD21_1: LD21.1(C) R33.1

Not connected (* = marked no-connect by the designer): IC4 4(NC); IC7 4(NC); J13 6 7 8

### Notes on the sheet
- 0
- 1
- Lased driver ID=0x20 (32)
  REV = 1.0
- Project/Equipment
- Document
- Designer
- Drawn by
- Check.by
- Copyright WUT ISE 2018.
  This documentation describes Open Hardware and is licensed under the CERN OHL v.1.1. You may redistribute and modify this documentation under the terms of the CERN OHL v.1.1. (http://ohwr.org/CERNOHL). This documentation is distributed WITHOUT ANY EXPRESS OR IMPLIED WARRANTY, INCLUDING OF MERCHANTABILITY, SATISFACTORY QUALITY AND FITNESS FOR A PARTICULAR PURPOSE. Please see the CERN OHL v.1.1 for applicable conditions.
- Contact
- File
- Last Mod.
- Print Date
- Sheet
- Size
- A3
- of
- Rev
- (in symbol 5M160ZE64A5N, part A) BANK 1
- (in symbol 5M160ZE64A5N, part B) BANK 2
- (in symbol AVX_009159012761916) 11

### Library data of the parts
C2-C4 C11 C18-C21 C61 C231 C232 = CC0402_1UF_16V_10%_X5R: as C8 on sheet Laser_driver; Part Number: CC0402_1UF_16V_10%_X5R; Component Kind: Standard; Component Type: Standard; Pin Count: 2; Value: 1uF; Status: Preferred; Manufacturer Part Number: CC0402_1UF_16V_10%_X5R; Case: 0402; Mounted: Yes; Socket: No; SMD: Yes; Sense: No; Manufacturer1 Example: TDK; Manufacturer1 ComponentHeight: 0.55mm; HelpURL: \\cern.ch\dfs\Applications\Altium\Datasheets\CC0402_X5R_TDK_C.pdf; Author: CERN DEM JLC; CreateDate: 25.10.2012; LatestRevisionDate: 25.10.2012
D5 = BAT165: Schottky Diode; Part Description: Medium Power AF Schottky Diode; Manufacturer: INFINEON; Voltage: 40V; Power: 750mA; PressFit: No; Bonding: No; Part Number: BAT165; Component Kind: Standard; Component Type: Standard; Device: BAT165; PackageDescription: Small Outline Diode (SOD-323), 1.70mm W X 1.25mm L X 1.10mm H body,  IPC Medium Density; Manufacturer Part Number: BAT165; Pin Count: 2; Case: SOD-323; Mounted: Yes; Socket: No; SMD: Yes; Sense: No; ComponentHeight: 1.1mm; HelpURL: \\cern.ch\dfs\Applications\Altium\Datasheets\BAT165.pdf; Author: CERN DEM JLC; CreateDate: 12.11.2014; LatestRevisionDate: 12.11.2014
IC3 = 5M160ZE64A5N: MAX V 1.8V CPLD, 54 IOs, 160 Logic Elements, 64-Pin EQFP, Automotive Temperature, Speed Grade 5, Pb-Free; Manufacturer: ALTERA; PressFit: No; Bonding: No; Part Number: 5M160ZE64A5N; Component Kind: Standard; Component Type: Standard; Device: 5M160ZE64A5N; PackageDescription: QFP, 0.40mm Pitch, Square; 64 pin, 7.00mm L X 7.00mm W X 1.20mm H body (w/Thermal Tab 5.50 X 5.50mm), IPC Medium Density; Status: Not Recommended; Part Description: MAX V 1.8V CPLD, 54 IOs, 160 Logic Elements, 64-Pin EQFP, Automotive Temperature, Speed Grade 5, Pb-Free; Manufacturer Part Number: 5M160ZE64A5N; Pin Count: 65; Case: QFP64; Mounted: Yes; Socket: No; SMD: Yes; Sense: No; ComponentHeight: 1.2mm; HelpURL: \\cern.ch\dfs\Applications\Altium\Datasheets\5M160ZE64A5N.pdf; ComponentLink1URL: \\cern.ch\dfs\Applications\Altium\Datasheets\5M160ZE64A5N_Package.pdf; ComponentLink1Description: Package Drawing; ComponentLink2URL: \\cern.ch\dfs\Applications\Altium\Datasheets\5M160ZE64A5N_Pinout.pdf; ComponentLink2Description: Pinout; Author: CERN DEM JLC; CreateDate: 07.01.2015; LatestRevisionDate: 27.10.2022
IC4 = AP2112K-1.8TRG1: 600mA CMOS Low Dropout Linear Regulator with Enable; Part Description: 1.8V 600mA CMOS Low Dropout Linear Regulator with Enable; Manufacturer: DIODES INCORPORATED; PressFit: No; Bonding: No; Part Number: AP2112K-1.8TRG1; Component Kind: Standard; Component Type: Standard; Device: AP2112K-1.8TRG1; PackageDescription: SOT23, 0.95mm Pitch; 5 Pin, 1.6mm W X 3.0mm L X 1.40mm H body, IPC Medium Density; Manufacturer Part Number: AP2112K-1.8; Pin Count: 5; Case: SOT25; Mounted: Yes; Socket: No; SMD: Yes; Sense: No; ComponentHeight: 1.4mm; HelpURL: \\cern.ch\dfs\Applications\Altium\Datasheets\AP2112K-1.8TRG1.pdf; Author: CERN DEM JLC; CreateDate: 13.06.2018; LatestRevisionDate: 27.06.2022
IC7 = AP2112K-3.3TRG1: as IC20 on sheet Laser_driver; Part Number: AP2112K-3.3TRG1; Component Kind: Standard; Component Type: Standard; Device: AP2112K-3.3TRG1; PackageDescription: SOT23, 0.95mm Pitch; 5 Pin, 1.6mm W X 3.0mm L X 1.40mm H body, IPC Medium Density; Manufacturer Part Number: AP2112K-3.3; Pin Count: 5; Case: SOT25; Mounted: Yes; Socket: No; SMD: Yes; Sense: No; ComponentHeight: 1.4mm; HelpURL: \\cern.ch\dfs\Applications\Altium\Datasheets\AP2112K-3.3TRG1.pdf; Author: CERN DEM MR; CreateDate: 13.12.2017; LatestRevisionDate: 27.06.2022
J4 J10 = PCB Edge Connector 12 (2x6): Part Number: EDGE10T1B6_P200W1000L0F100X400; Part Description: 10 Contacts Board Edge Connector, Pitch 2mm, Length 0mm, Width 10mm, Finger Lenght 4mm, Finger Width 1mm; Mounted: No; PressFit: No; Component Kind: Standard (No BOM); Component Type: Standard (No BOM); Pin Count: 12; Socket: No; SMD: No; Sense: No; Status: None; ComponentHeight: 0mm; HelpURL: \\cern.ch\dfs\Applications\Altium\Datasheets\EDGE10T1B6_P200W1000L0F100X400.pdf; Author: CERN DEM MR; CreateDate: 14.02.2018; LatestRevisionDate: 14.02.2018
J9 J11 = PCB Edge Connector 12 (2x6) R: PCB Edge Connector 12 (2x6); Part Description: 12 Contacts Board Edge Connector, Pitch 2mm, Length 0mm, Width 10mm, Finger Lenght 4mm, Finger Width 1mm; Mounted: No; PressFit: No; Part Number: EDGE12T5B10_P200W1000L0F100X400; Component Kind: Standard (No BOM); Component Type: Standard (No BOM); Pin Count: 12; Socket: No; SMD: No; Sense: No; Status: None; ComponentHeight: 0mm; HelpURL: \\cern.ch\dfs\Applications\Altium\Datasheets\EDGE10T5B10_P200W1000L0F100X400.pdf; Author: GK; CreateDate: 14.02.2018; LatestRevisionDate: 14.02.2018
J13 = TC2050-IDC: as J1 on sheet Laser_driver; Part Number: TC2050-IDC; Component Kind: Standard (No BOM); Component Type: Standard (No BOM); Pin Count: 10; Family: TC2050-IDC; Socket: No; SMD: Yes; Sense: No; Status: None; ComponentHeight: 0mm; HelpURL: \\cern.ch\dfs\Applications\Altium\Datasheets\TC2050-IDC.pdf; Author: CERN DEM HF; CreateDate: 02.05.2024; LatestRevisionDate: 02.05.2024; PackageDescription: 10 X 31mil Diameter SMD Pad For TC2030-MCP Legged Connector
J98 J99 = AVX_009159012761916: Open Ended Card Edge Connector, 9159 Series; Part Number: AVX_0009159012761916; Part Description: 10 Contacts, 2mm Pitch, Open Ended Card Edge Connector, 9159 Series; Manufacturer: AVX; PressFit: No; Component Kind: Standard; Component Type: Standard; Pin Count: 12; Mounted: Yes; Socket: No; SMD: No; Sense: No; Status: None; Manufacturer Part Number: 009159012761916; ComponentHeight: 1.6mm; HelpURL: \\cern.ch\dfs\Applications\Altium\Datasheets\AVX_00 9159 010 061 916.pdf; Author: GK; CreateDate: 13.02.2018; LatestRevisionDate: 13.02.2018
LD1 LD18-LD21 = LED_KINGBRIGHT_KP-1608CGCK: LED Green 1C 2A; Part Description: 1.6x0.8mm SMD Chip Green LED Lamp; PressFit: No; Bonding: No; Part Number: LED_KINGBRIGHT_KP-1608CGCK; Component Kind: Standard; Component Type: Standard; Color: Green; PackageDescription: SMT Green LED, Case 0603, Body L 1.60mm x W 0.80mm x H 1.10mm; Manufacturer: KINGBRIGHT; Manufacturer Part Number: KP-1608CGCK; Pin Count: 2; Case: 0603; Mounted: Yes; Socket: No; SMD: Yes; Sense: No; ComponentHeight: 1.1mm; HelpURL: \\cern.ch\dfs\Applications\Altium\Datasheets\LED_KINGBRIGHT_KP-1608CGCK.pdf; Author: CERN DEM HF; CreateDate: 01.10.2021; LatestRevisionDate: 01.10.2021
MP1-MP4 = 97730306330R: WA-SMSI SMT Steel Spacer with internal Thread Bottom closed, OD 3.3mm, M1.6 x 3mm; Manufacturer: Wurth Elektronik; Inside Thread Length: 1.8mm; Surface: Tin; ComponentLink1Description: Website Link; ComponentLink1URL: https://www.we-online.com/redexpert/article/97730306330R?ad; ComponentLink2Description: Datasheet Link; ComponentLink2URL: https://www.we-online.com/redexpert/spec/97730306330R?ad; Manufacturer Part Number: 97730306330R; Category: SMT Spacers; Match Code: WA-SMSI; Mount: Surface Mount; Operating Temperature Max: 150°C; Operating Temperature Min: -55°C; Packaging: Tape and Reel; Height: 3mm; Material: Steel; Outside Diameter: 3.3mm; Thread Size: M1.6
NT1-NT13 NT? = Net Tie 3: Part Description: Net Tie (2 Nets); Mounted: No; Part Number: Net Tie 3; Component Type: Net Tie; Pin Count: 2; Family: Net Tie; Socket: No; SMD: No; Sense: No; Status: None; ComponentHeight: 0mm; HelpURL: Undefined; Author: CERN DEM HF; CreateDate: 23.09.2024; LatestRevisionDate: 23.09.2024; PackageDescription: SMD Net Tie
R26 R27 R32-R34 = R0402_3K3_1%_0.0625W_100PPM: as R1 on sheet Laser_driver; Part Number: R0402_3K3_1%_0.0625W_100PPM; Component Kind: Standard; Component Type: Standard; Pin Count: 2; Value: 3k3; Status: Not Recommended; Power: 0.0625W; Manufacturer Part Number: R0402_3K3_1%_0.0625W_100PPM; Case: 0402; Mounted: Yes; Sense: No; Socket: No; SMD: Yes; Manufacturer1 Example: YAGEO PHYCOMP; Manufacturer1 ComponentHeight: 0.4mm; HelpURL: \\cern.ch\dfs\Applications\Altium\Datasheets\R0402_Phycomp_RC0402.pdf; Author: CERN DEM JLC; CreateDate: 03.12.2007; LatestRevisionDate: 17.10.2012
SW2 = SW_OMRON_A6H-4102: 4 Ways SPST DIP Switch; Part Description: 4 Ways Ultra-low Profile, Half-pitch, SPST DIP Switch with Seal Tape, Rating 25mA 24VDC; Manufacturer: OMRON; PressFit: No; Part Number: SW_OMRON_A6H-4102; Component Kind: Standard; Component Type: Standard; Pin Count: 8; PackageDescription: Pitch 1.27mm, Body 6.31 x 4.5mm, 4 Ways SPST Surface-Mounting DIP Switch, OMRON A6H; Family: Switch; Mounted: Yes; Socket: No; SMD: Yes; Sense: No; Status: None; Manufacturer Part Number: A6H-4102; ComponentHeight: 1.45mm; HelpURL: \\cern.ch\dfs\Applications\Altium\Datasheets\SW_OMRON_A6H-4102.pdf; Author: CERN DEM JLC; CreateDate: 17.12.2013; LatestRevisionDate: 17.12.2013